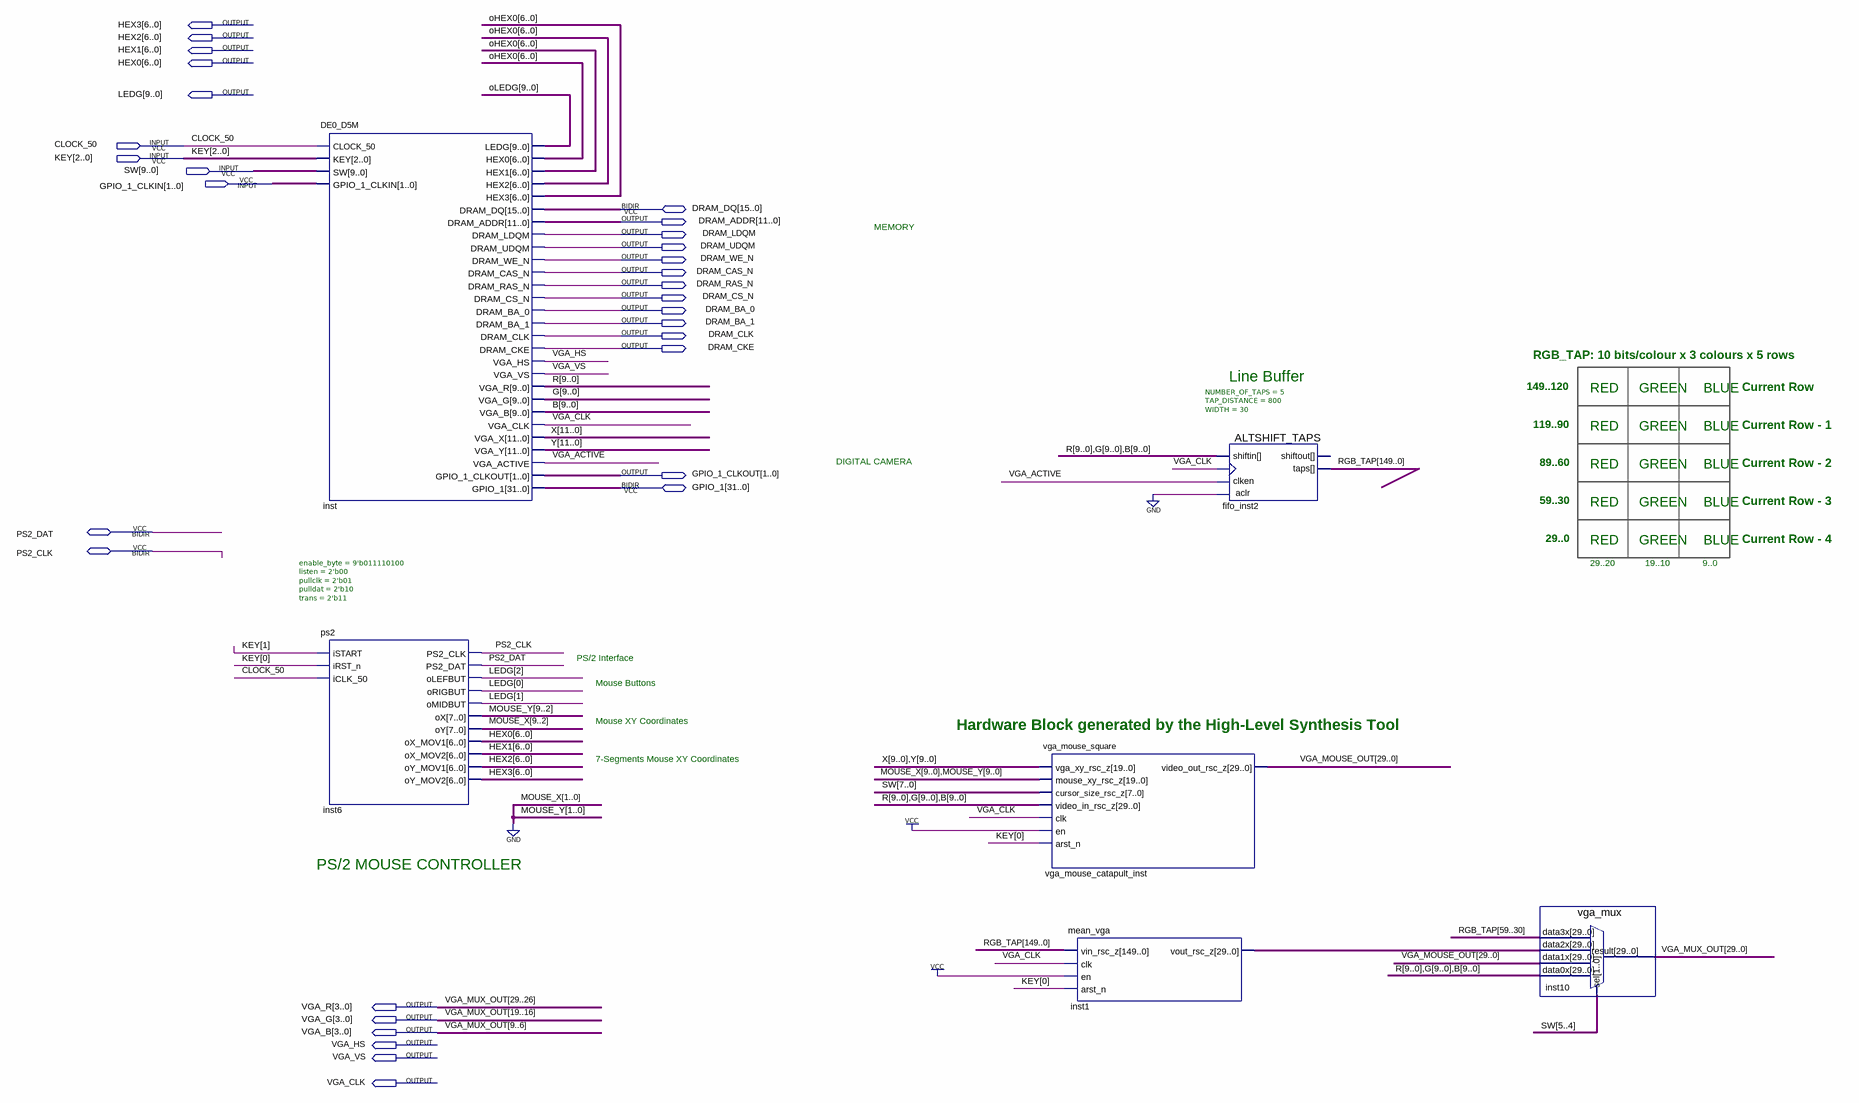
[diagram p0: schematic sheet]
// Quartus schematic TOP_DE0_CAMERA_MOUSE.bdf as structural Verilog: 6 symbols, 31 pins
module TOP_DE0_CAMERA_MOUSE (
  input  CLOCK_50,
  input  [2:0] KEY,
  input  [9:0] SW,
  input  [1:0] GPIO_1_CLKIN,
  inout  [15:0] DRAM_DQ,
  inout  [31:0] GPIO_1,
  inout  PS2_DAT,
  inout  PS2_CLK,
  output [6:0] HEX3,
  output [6:0] HEX2,
  output [6:0] HEX1,
  output [6:0] HEX0,
  output [9:0] LEDG,
  output [11:0] DRAM_ADDR,
  output DRAM_LDQM,
  output DRAM_UDQM,
  output DRAM_WE_N,
  output DRAM_CAS_N,
  output DRAM_RAS_N,
  output DRAM_CS_N,
  output DRAM_BA_0,
  output DRAM_BA_1,
  output DRAM_CLK,
  output DRAM_CKE,
  output [1:0] GPIO_1_CLKOUT,
  output [3:0] VGA_R,
  output [3:0] VGA_G,
  output [3:0] VGA_B,
  output VGA_HS,
  output VGA_VS,
  output VGA_CLK
);

  wire VGA_ACTIVE;
  wire [6:0] oHEX0;
  wire [9:0] B, G, MOUSE_X, oLEDG, R;
  wire [9:2] MOUSE_Y;
  wire [11:0] X, Y;
  wire [25:0] VGA_MUX_OUT;
  wire [29:0] inst1_vout_rsc_z, VGA_MOUSE_OUT;
  wire [149:0] RGB_TAP;

  DE0_D5M inst (
    .CLOCK_50(CLOCK_50), .KEY(KEY), .SW(SW), .GPIO_1_CLKIN(GPIO_1_CLKIN), .LEDG(oLEDG), .HEX0(oHEX0),
    .HEX1(oHEX0), .HEX2(oHEX0), .HEX3(oHEX0), .DRAM_ADDR(DRAM_ADDR), .DRAM_LDQM(DRAM_LDQM),
    .DRAM_UDQM(DRAM_UDQM), .DRAM_WE_N(DRAM_WE_N), .DRAM_CAS_N(DRAM_CAS_N), .DRAM_RAS_N(DRAM_RAS_N),
    .DRAM_CS_N(DRAM_CS_N), .DRAM_BA_0(DRAM_BA_0), .DRAM_BA_1(DRAM_BA_1), .DRAM_CLK(DRAM_CLK),
    .DRAM_CKE(DRAM_CKE), .VGA_HS(VGA_HS), .VGA_VS(VGA_VS), .VGA_R(R), .VGA_G(G), .VGA_B(B),
    .VGA_CLK(VGA_CLK), .VGA_X(X), .VGA_Y(Y), .VGA_ACTIVE(VGA_ACTIVE), .GPIO_1_CLKOUT(GPIO_1_CLKOUT),
    .DRAM_DQ(DRAM_DQ), .GPIO_1(GPIO_1));
  ps2 #(.enable_byte(9'b011110100), .listen(2'b00), .pullclk(2'b01), .pulldat(2'b10), .trans(2'b11)) inst6 (
    .iSTART(KEY[1]), .iRST_n(KEY[0]), .iCLK_50(CLOCK_50), .oLEFBUT(LEDG[2]), .oRIGBUT(LEDG[0]),
    .oMIDBUT(LEDG[1]), .oX(MOUSE_Y), .oY(MOUSE_X[9:2]), .oX_MOV1(HEX0), .oX_MOV2(HEX1), .oY_MOV1(HEX2),
    .oY_MOV2(HEX3), .PS2_CLK(PS2_CLK), .PS2_DAT(PS2_DAT));
  vga_mouse_square vga_mouse_catapult_inst (
    .vga_xy_rsc_z({X[9:0], Y[9:0]}), .mouse_xy_rsc_z({MOUSE_X, MOUSE_Y, 2'b00}), .cursor_size_rsc_z(SW[7:0]),
    .video_in_rsc_z({R, G, B}), .clk(VGA_CLK), .en(1'b1), .arst_n(KEY[0]), .video_out_rsc_z(VGA_MOUSE_OUT));
  mean_vga inst1 (.vin_rsc_z(RGB_TAP), .clk(VGA_CLK), .en(1'b1), .arst_n(KEY[0]), .vout_rsc_z(inst1_vout_rsc_z));
  ALTSHIFT_TAPS #(.NUMBER_OF_TAPS(5), .TAP_DISTANCE(800), .WIDTH(30)) fifo_inst2 (
    .shiftin({R, G, B}), .clken(VGA_ACTIVE), .clock(VGA_CLK), .aclr(1'b0), .taps(RGB_TAP));  // open: shiftout
  vga_mux inst10 (
    .data3x(RGB_TAP[59:30]), .data2x(inst1_vout_rsc_z), .data1x(VGA_MOUSE_OUT), .data0x({R, G, B}),
    .sel(SW[5:4]), .result({VGA_R, VGA_MUX_OUT[25:20], VGA_G, VGA_MUX_OUT[15:10], VGA_B, VGA_MUX_OUT[5:0]}));

  // Other names for the same wires on the sheet: VGA_MUX_OUT (some bits) = {VGA_R, VGA_G, VGA_B}

  // Notes on the sheet:
  //   MEMORY
  //   RGB_TAP: 10 bits/colour x 3 colours x 5 rows
  //   Line Buffer
  //   149..120
  //   RED     GREEN    BLUE
  //   Current Row
  //   119..90
  //   RED     GREEN    BLUE
  //   Current Row - 1
  //   DIGITAL CAMERA
  //   89..60
  //   RED     GREEN    BLUE
  //   Current Row - 2
  //   59..30
  //   RED     GREEN    BLUE
  //   Current Row - 3
  //   29..0
  //   RED     GREEN    BLUE
  //   Current Row - 4
  //   29..20            19..10             9..0
  //   PS/2 Interface
  //   Mouse Buttons
  //   Mouse XY Coordinates
  //   Hardware Block generated by the High-Level Synthesis Tool
  //   7-Segments Mouse XY Coordinates
  //   PS/2 MOUSE CONTROLLER
endmodule
